# Altium schematic sheet Sheet1.SchDoc
size A
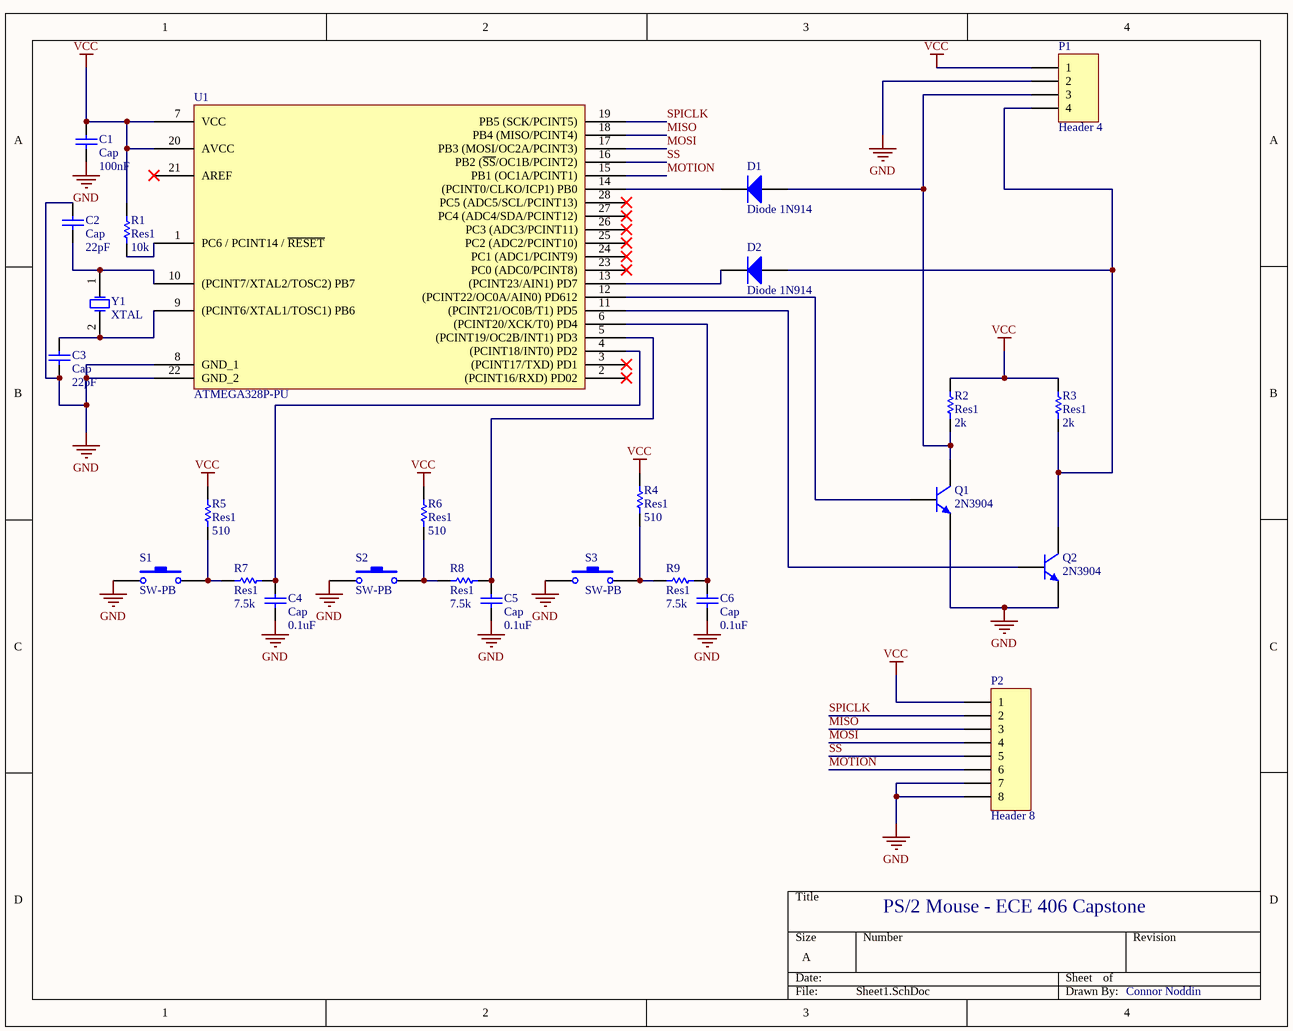
[diagram p0: Sheet1.SchDoc]

## Parts
C1  Cap  value 100nF  [RAD-0.3]
C2  Cap  value 22pF  [RAD-0.3]
C3  Cap  value 22pF  [RAD-0.3]
C4  Cap  value 0.1uF  [RAD-0.3]
C5  Cap  value 0.1uF  [RAD-0.3]
C6  Cap  value 0.1uF  [RAD-0.3]
D1  Diode 1N914  [DO-35]
D2  Diode 1N914  [DO-35]
P1  Header 4  [HDR1X4]
P2  Header 8  [HDR1X8]
Q1  2N3904  [TO-92A]
Q2  2N3904  [TO-92A]
R1  Res1  value 10k  [AXIAL-0.3]
R2  Res1  value 2k  [AXIAL-0.3]
R3  Res1  value 2k  [AXIAL-0.3]
R4  Res1  value 510  [AXIAL-0.3]
R5  Res1  value 510  [AXIAL-0.3]
R6  Res1  value 510  [AXIAL-0.3]
R7  Res1  value 7.5k  [AXIAL-0.3]
R8  Res1  value 7.5k  [AXIAL-0.3]
R9  Res1  value 7.5k  [AXIAL-0.3]
S1  SW-PB  [SPST-2]
S2  SW-PB  [SPST-2]
S3  SW-PB  [SPST-2]
U1  ATMEGA328P-PU  [27_DIP_7.62mm]
Y1  XTAL  [R38]

## Nets
GND: C1.2 C2.1 C3.2 C4.1 C5.1 C6.1 P1.2 P2.7 P2.8 Q1.1(E) Q2.1(E) S1.1 S2.1 S3.1 U1.8(GND_1) U1.22(GND_2)
VCC: C1.1 P1.1 P2.1 R1.2 R2.2 R3.2 R4.2 R5.2 R6.2 U1.7(VCC) U1.20(AVCC)
MISO: P2.3 U1.18(PB4_(MISO/PCINT4))
MOSI: P2.4 U1.17(PB3_(MOSI/OC2A/PCINT3))
MOTION: P2.6 U1.15(PB1_(OC1A/PCINT1))
SPICLK: P2.2 U1.19(PB5_(SCK/PCINT5))
SS: P2.5 U1.16(PB2_(~{SS}/OC1B/PCINT2))
NetC2_2: C2.2 U1.10((PCINT7/XTAL2/TOSC2)_PB7) Y1.1(OSC1)
NetC3_1: C3.1 U1.9((PCINT6/XTAL1/TOSC1)_PB6) Y1.2(OSC2)
NetC4_2: C4.2 R7.2 U1.4((PCINT18/INT0)_PD2)
NetC5_2: C5.2 R8.2 U1.5((PCINT19/OC2B/INT1)_PD3)
NetC6_2: C6.2 R9.2 U1.6((PCINT20/XCK/T0)_PD4)
NetD1_1: D1.1(A) P1.3 Q1.3(C) R2.1
NetD1_2: D1.2(K) U1.14((PCINT0/CLKO/ICP1)_PB0)
NetD2_1: D2.1(A) P1.4 Q2.3(C) R3.1
NetD2_2: D2.2(K) U1.13((PCINT23/AIN1)_PD7)
NetQ1_2: Q1.2(B) U1.12((PCINT22/OC0A/AIN0)_PD612)
NetQ2_2: Q2.2(B) U1.11((PCINT21/OC0B/T1)_PD5)
NetR1_1: R1.1 U1.1(PC6_/_PCINT14_/_~{RESET})
NetR4_1: R4.1 R9.1 S3.2
NetR5_1: R5.1 R7.1 S1.2
NetR6_1: R6.1 R8.1 S2.2

Not connected (* = marked no-connect by the designer): U1 2((PCINT16/RXD)_PD02)* 3((PCINT17/TXD)_PD1)* 21(AREF)* 23(PC0_(ADC0/PCINT8))* 24(PC1_(ADC1/PCINT9))* 25(PC2_(ADC2/PCINT10))* 26(PC3_(ADC3/PCINT11))* 27(PC4_(ADC4/SDA/PCINT12))* 28(PC5_(ADC5/SCL/PCINT13))*

## Notes on the sheet
- PS/2 Mouse - ECE 406 Capstone
- Connor Noddin

## Library data of the parts
C1-C6 = Cap: Capacitor; Published: 8-Jun-2000; LatestRevisionDate: 17-Jul-2002; LatestRevisionNote: Re-released for DXP Platform.; PackageReference: RAD-0.3; Publisher: Altium Limited; PackageDescription: Radial Cap, Thru-Hole; 2 Leads; 0.3 in Pin Spacing
D1 D2 = Diode 1N914: High Conductance Fast Diode; Published: 8-Jun-2000; LatestRevisionDate: 17-Jul-2002; LatestRevisionNote: Re-released for DXP Platform.; DatasheetVersion: 1997; PackageReference: DO-35; Publisher: Altium Limited; PackageDescription: Diode, Axial; Body 3.8 x 1.9 mm (LxDia. max), Lead Dia. 0.53 mm (max); Code_JEDEC: DO-204-AH; ComponentLink1Description: Manufacturer Link; ComponentLink1URL: http://www.fairchildsemi.com/; ComponentLink2Description: Datasheet; ComponentLink2URL: http://www.fairchildsemi.com/ds/1N%2F1N4448.pdf
P1 = Header 4: Header, 4-Pin; LatestRevisionDate: 17-Jul-2002; LatestRevisionNote: Re-released for DXP Platform.; Publisher: Altium Limited
P2 = Header 8: Header, 8-Pin; LatestRevisionDate: 17-Jul-2002; LatestRevisionNote: Re-released for DXP Platform.; Publisher: Altium Limited
Q1 Q2 = 2N3904: NPN General Purpose Amplifier; Published: 8-Jun-2000; LatestRevisionDate: 15-Jan-2003; LatestRevisionNote: PCB Footprint 'BCY-W3/D4.7' replaced; DatasheetVersion: 1997; PackageVersion: Sep-1998; PackageReference: TO-92A; Publisher: Altium Limited; PackageDescription: TO, Flat Index; 3 In-Line, Axial Leads; Body Dia. 4.5mm; Leads 0.51 x 0.48 mm (max); ComponentLink1Description: Manufacturer Link; ComponentLink1URL: http://www.fairchildsemi.com/; ComponentLink2Description: Datasheet; ComponentLink2URL: http://www.fairchildsemi.com/ds/2N%2F2N3904.pdf
R1-R9 = Res1: Resistor; Published: 8-Jun-2000; LatestRevisionDate: 17-Jul-2002; LatestRevisionNote: Re-released for DXP Platform.; PackageReference: AXIAL-0.3; Publisher: Altium Limited; PackageDescription: Axial Device, Thru-Hole; 2 Leads; 0.3 in Pin Spacing
S1-S3 = SW-PB: Switch; Published: 24-Mar-1999; LatestRevisionDate: 17-Jul-2002; LatestRevisionNote: Re-released for DXP Platform.; PackageReference: SPST-2; Publisher: Altium Limited; PackageDescription: Switch; 2 Leads
U1 = ATMEGA328P-PU: ATMEGA328P-PU; 8 bit Microcontroller AVR 20MHz 1; 32kb Flash; 2kb RAM; I2C SPI 2; Manufacturer: Microchip / Atmel; Number of PWM Channels: 6; Number of Timers/Counters: 3; Min Supply Voltage: 1.8V; Max Supply Voltage: 5.5V; Interface: I2C,SPI,UART,USART,2-Wire; Number of I/Os: 23; Oscillator Type: Internal; Data Bus Width: 8b; Number of SPI Channels: 1; Watchdog Timer: Yes; Peripherals: Brown-out Detect/Reset,POR,PWM,WDT; Manufacturer Part Number: ATMEGA328P-PU; RoHS: Yes; Category: Microcontrollers; Stock 1: 5280; Pricing 1: 1=2,08000, 25=1,91000, 100=1,73000 (USD); Mount: Through Hole; Case/Package: PDIP; Number of Pins: 28; Contact Plating: Tin,Matte; Min Operating Temperature: -40°C; Max Operating Temperature: 85°C; Package Quantity: 14; Core Architecture: AVR; RAM Size: 2KB; Number of ADC Channels: 6; Packaging: Rail/Tube; Frequency: 20MHz; Number of Programmable I/O: 23; Max Frequency: 20MHz; Number of I2C Channels: 1; Memory Type: FLASH; Memory Size: 32KB; Length: 37.4mm; Height: 3.28mm; Width: 6.76mm; Radiation Hardening: No; REACH SVHC: No SVHC; Lead Free: Lead Free; ComponentLink1URL: https://datasheet.ciiva.com/20168/73-4283-20168380.pdf?src-supplier=Rapid+Electronics; ComponentLink1Description: https://datasheet.ciiva.com/20168/73-4283-20168380.pdf?src-supplier=Rapid+Electronics; ComponentLink2URL: https://datasheet.ciiva.com/19457/2139111-19457070.pdf?src-supplier=Jameco; ComponentLink2Description: https://datasheet.ciiva.com/19457/2139111-19457070.pdf?src-supplier=Jameco; ComponentLink3URL: https://datasheet.ciiva.com/1157/1684409-1157696.pdf?src-supplier=Element14; ComponentLink3Description: https://datasheet.ciiva.com/1157/1684409-1157696.pdf?src-supplier=Element14; ComponentLink4URL: https://datasheet.ciiva.com/26818/atmega328p-pu-26818578.pdf?src-supplier=IIIC; ComponentLink4Description: https://datasheet.ciiva.com/26818/atmega328p-pu-26818578.pdf?src-supplier=IIIC; ComponentLink5URL: https://datasheet.ciiva.com/29119/155197-da-01-en-microcontr-atmega328p-pu-8bit-pdip-28-29119593.pdf?src-supplier=Conrad; ComponentLink5Description: https://datasheet.ciiva.com/29119/155197-da-01-en-microcontr-atmega328p-pu-8bit-pdip-28-29119593.pdf?src-supplier=Conrad; ComponentLink6URL: https://datasheet.ciiva.com/15213/getdatasheetpartid-318533-15213133.pdf?src-supplier=Verical; ComponentLink6Description: https://datasheet.ciiva.com/15213/getdatasheetpartid-318533-15213133.pdf?src-supplier=Verical; Supplier 1: Digi-Key; Supplier Part Number 1: ATMEGA328P-PU-ND
Y1 = XTAL: Crystal Oscillator; Published: 8-Jun-2000; LatestRevisionDate: 17-Jul-2002; LatestRevisionNote: Re-released for DXP Platform.; PackageReference: R38; Publisher: Altium Limited; PackageDescription: Crystal, Thru-Hole; 2 Leads; Body 3.1 x 8.2 mm (Dia.xH)